# EAGLE design HueMini (EAGLE 6.5.0)
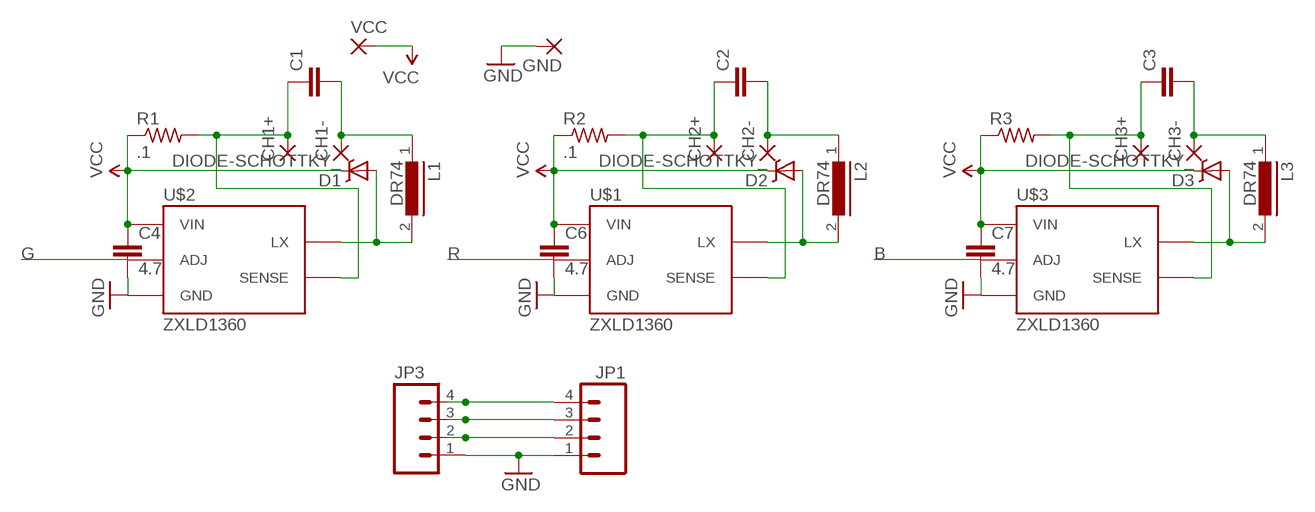
[diagram p0: schematic, sheet 1]

## Parts
C1  CAP0603-CAP  [0603-CAP]
C2  CAP0603-CAP  [0603-CAP]
C3  CAP0603-CAP  [0603-CAP]
C4  4.7  C-EUC1206  [C1206]
C6  4.7  C-EUC1206  [C1206]
C7  4.7  C-EUC1206  [C1206]
CH1+  SMD5  [SMD2,54-5,08]
CH1-  SMD5  [SMD2,54-5,08]
CH2+  SMD5  [SMD2,54-5,08]
CH2-  SMD5  [SMD2,54-5,08]
CH3+  SMD5  [SMD2,54-5,08]
CH3-  SMD5  [SMD2,54-5,08]
D1  DIODE-SCHOTTKY_  [SMA-DIODE]
D2  DIODE-SCHOTTKY_  [SMA-DIODE]
D3  DIODE-SCHOTTKY_  [SMA-DIODE]
GND  SMD5  [SMD2,54-5,08]
JP1  M04PTH  [1X04]
JP3  M04PTH  [1X04]
L1  DR74  [DR74]
L2  DR74  [DR74]
L3  DR74  [DR74]
R1  .1  R-US_R0603  [R0603]
R2  .1  R-US_R0603  [R0603]
R3  R-US_R0603  [R0603]
U$1  ZXLD1360  [SOT23-5]
U$2  ZXLD1360  [SOT23-5]
U$3  ZXLD1360  [SOT23-5]
VCC  SMD5  [SMD2,54-5,08]

## Nets
B: JP1.2 JP3.2 U$3.3(ADJ)
G: JP1.4 JP3.4 U$2.3(ADJ)
GND: C4.2 C6.2 C7.2 GND.1(P) JP1.1 JP3.1 U$1.2(GND) U$2.2(GND) U$3.2(GND)
N$1: C2.2 CH2-.1(P) L2.1
N$2: C2.1 CH2+.1(P) R2.2 U$1.4(SENSE)
N$3: C1.2 CH1-.1(P) L1.1
N$4: C1.1 CH1+.1(P) R1.2 U$2.4(SENSE)
N$5: D2.A L2.2 U$1.1(LX)
N$6: C3.2 CH3-.1(P) L3.1
N$7: C3.1 CH3+.1(P) R3.2 U$3.4(SENSE)
N$8: D3.A L3.2 U$3.1(LX)
N$9: D1.A L1.2 U$2.1(LX)
R: JP1.3 JP3.3 U$1.3(ADJ)
VCC: C4.1 C6.1 C7.1 D1.C D2.C D3.C R1.1 R2.1 R3.1 U$1.5(VIN) U$2.5(VIN) U$3.5(VIN) VCC.1(P)

## Library data of the parts
C1-C3 = SparkFun:CAP: Capacitor Standard 0603 ceramic capacitor, and 0.1" leaded capacitor.
C4 C6 C7 = rcl:C-EU: CAPACITOR, European symbol
CH1+ CH1- CH2+ CH2- CH3+ CH3- GND VCC = wirepad:SMD5: SMD PAD
D1-D3 = SparkFun:DIODE-SCHOTTKY
JP1 JP3 = SparkFun:M04: Header 4 Standard 4-pin 0.1" header. Use with straight break away headers (SKU : PRT-00116), right angle break away headers (PRT-00553), swiss pins (PRT-00743), machine pins (PRT-00117), and female headers (PRT-00115). Molex polarized connector foot print use with SKU : PRT-08231 with associated crimp pins and housings. 1MM SMD Version SKU: PRT-10208
L1-L3 = inductors:DR74: High Power Density, High Efficiency, Shielded Inductors Source: coiltronics_dr_series.pdf
R1-R3 = resistor:R-US_: RESISTOR, American symbol
U$1-U$3 = SparkFun:ZXLD1360: Adjustable constant current switching driver for high-power LEDs

## Board
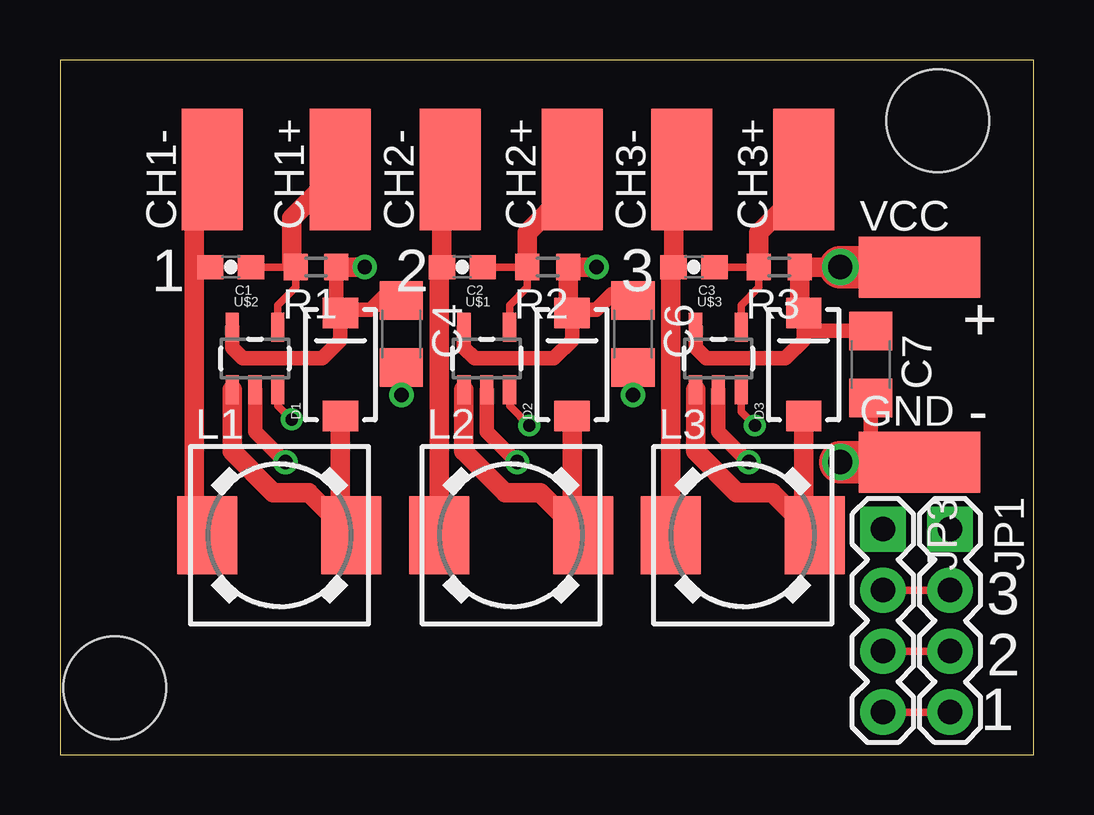
[diagram p1: board, top side]
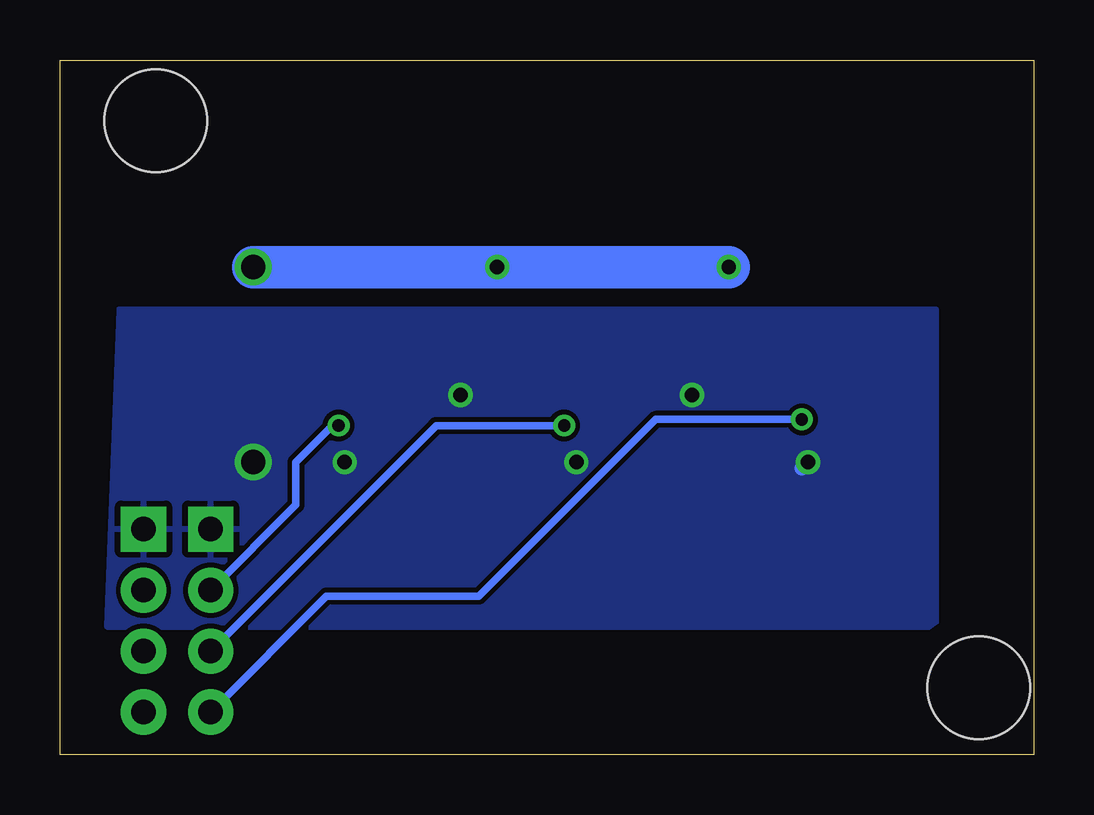
[diagram p2: board, bottom side, seen from below]

Size 40.56 x 28.95 mm. Coordinates in mm from the lower left corner, seen from the top.
Outline: 0,0 40.56,0 40.56,28.95 0,28.95 0,0
Copper layers (1*16): Top 0.035mm / dielectric 1.5mm / Bottom 0.035mm
Design rules "default": minimum track width 10mil, minimum drill 24mil, track to track 8mil, track to pad 8mil, pad to pad 8mil, via to via 8mil, smd to smd 0mil, copper to edge 40mil, drill to drill 8mil, minimum pad ring 10mil, minimum via ring 8mil, stop-mask expansion 4mil, vias tented up to drill 0mil, thermal gap 10mil
Holes 4.27 mm at 2.29,2.79 36.58,26.42

### Footprints (pad centres in the part's own frame; a part is rotated, then mirrored left to right if it is on the bottom)
0603-CAP = smd 1.1 x 1: 1 -0.85,0; 2 0.85,0
C1206 = smd 1.6 x 1.8: 1 -1.4,0; 2 1.4,0
SMD2,54-5,08 = smd 2.54 x 5.08: 1 0,0
SMA-DIODE = smd 1.27 x 1.47: A -2.15,0; C 2.15,0
1X04 = drill 1.016 pad 1.88 square: 1 0,0 | drill 1.016 pad 1.88: 2 2.54,0; 3 5.08,0; 4 7.62,0
DR74 = smd 2.5 x 3.25: 1 -3,0; 2 3,0
R0603 = smd 1 x 1.1: 1 -0.85,0; 2 0.85,0
SOT23-5 = smd 0.55 x 1.2: 1 -0.95,-1.3; 2 0,-1.3; 3 0.95,-1.3; 4 0.95,1.3; 5 -0.95,1.3

### Placement (x,y rotation side)
C1  7.11,20.32 180 top
C2  16.76,20.32 180 top
C3  26.42,20.32 180 top
C4  14.22,17.53 270 top
C6  23.88,17.53 270 top
C7  33.78,16.26 270 top
CH1+  11.68,24.38 0 top
CH1-  6.35,24.38 0 top
CH2+  21.34,24.38 0 top
CH2-  16.26,24.38 0 top
CH3+  30.99,24.38 0 top
CH3-  25.91,24.38 0 top
D1  11.68,16.26 90 top
D2  21.34,16.26 90 top
D3  30.99,16.26 90 top
GND  35.81,12.19 270 top
JP1  37.08,9.4 270 top
JP3  34.29,9.4 270 top
L1  9.14,9.14 0 top
L2  18.8,9.14 0 top
L3  28.45,9.14 0 top
R1  10.67,20.32 180 top
R2  20.32,20.32 180 top
R3  29.97,20.32 180 top
U$1  17.78,16.51 0 top
U$2  8.13,16.51 0 top
U$3  27.43,16.51 0 top
VCC  35.81,20.32 270 top

### Tracks (layer width: path | path; a pad name or v marks a point on that pad's centre or on a via)
B  (via drill 0.51)
  Top 0.305: U$3.3 28.38,14.29 v28.96,13.72 | JP3.2 JP1.2
  Bottom 0.305: v28.96,13.72 29.21,13.72 30.73,12.19 30.73,10.41 JP3.2
G  (via drill 0.51)
  Top 0.305: U$2.3 9.08,14.54 v9.65,13.97 | JP3.4 JP1.4
  Bottom 0.305: v9.65,13.97 15.75,13.97 23.11,6.6 29.46,6.6 JP3.4
GND  (via drill 0.6, 0.61, 1.02)
  Top 0.61: U$2.2 8.13,13.46 v9.4,12.19 | U$1.2 17.78,13.46 v19.05,12.19 | U$3.2 27.43,13.46 v28.7,12.19 | C4.2 v14.22,14.99 | C6.2 v23.88,14.99 | C7.2 33.78,12.45 34.04,12.19
  Top 1.778: v32.51,12.19 34.04,12.19 GND.1
  Bottom 0.61: 9.65,11.94 v9.4,12.19
  pour Bottom: 4.06,18.54 38.1,18.54 38.61,5.33 4.06,5.33
N$1
  Top 0.813: L2.1 15.8,20.2 C2.2 15.91,24.04 CH2-.1
N$2
  Top 0.305: U$1.4 18.73,18.73 19.47,19.47 R2.2 C2.1
  Top 0.813: R2.2 19.47,21.76 21.08,23.37 21.08,24.13 CH2+.1
N$3
  Top 0.813: L1.1 5.59,9.14 5.59,20.32 | C1.2 5.59,20.32 | 5.59,20.32 5.59,23.62 6.35,23.62 CH1-.1
N$4
  Top 0.305: 9.65,20.49 R1.2 | R1.2 9.82,19.47 9.08,18.73 U$2.4 | C1.1 R1.2
  Top 0.813: 9.65,20.49 9.65,22.35 CH1+.1
N$5
  Top 0.813: U$1.1 16.83,12.63 18.54,10.92 20.02,10.92 L2.2 21.34,9.6 D2.A
N$6
  Top 0.813: L3.1 25.45,20.2 C3.2 25.57,24.04 CH3-.1
N$7
  Top 0.305: C3.1 R3.2 29.12,19.47 28.38,18.73 U$3.4
  Top 0.813: R3.2 29.12,21.76 30.23,22.86 30.23,23.62 CH3+.1
N$8
  Top 0.813: U$3.1 26.48,12.63 28.19,10.92 29.67,10.92 L3.2 30.99,9.6 D3.A
N$9
  Top 0.813: U$2.1 7.18,12.63 8.89,10.92 10.37,10.92 L1.2 11.68,9.6 D1.A
R  (via drill 0.51)
  Top 0.305: U$1.3 18.73,14.54 v19.56,13.72 | JP3.3 JP1.3
  Bottom 0.305: v19.56,13.72 24.89,13.72 JP3.3
VCC  (via drill 0.6, 1.02)
  Top 0.61: U$2.5 7.18,16.95 7.62,16.51 10.92,16.51 11.68,17.27 D1.C | R1.1 11.52,18.57 D1.C | U$1.5 16.83,16.95 17.27,16.51 20.57,16.51 21.34,17.27 D2.C 21.47,18.54 22.35,18.54 22.99,19.18 C6.1 | U$3.5 26.48,16.95 26.92,16.51 30.23,16.51 30.99,17.27 30.99,17.53 | 30.99,17.53 D3.C | VCC.1 35.05,20.32 34.29,19.56 | C7.1 31.12,17.66 30.99,17.53 | C4.1 13.59,19.18 12.95,18.54 11.82,18.54 D1.C
  Top 0.813: R1.1 v12.7,20.32 | v22.35,20.32 R2.1 21.17,18.57 D2.C | D3.C 30.82,18.57 R3.1 v32.51,20.32
  Top 1.778: v32.51,20.32 VCC.1
  Bottom 1.778: v12.7,20.32 v22.35,20.32 v32.51,20.32

### Text on the board
tPlace: 1 | 2 | 3 | + | - | 3 | 2 | 1